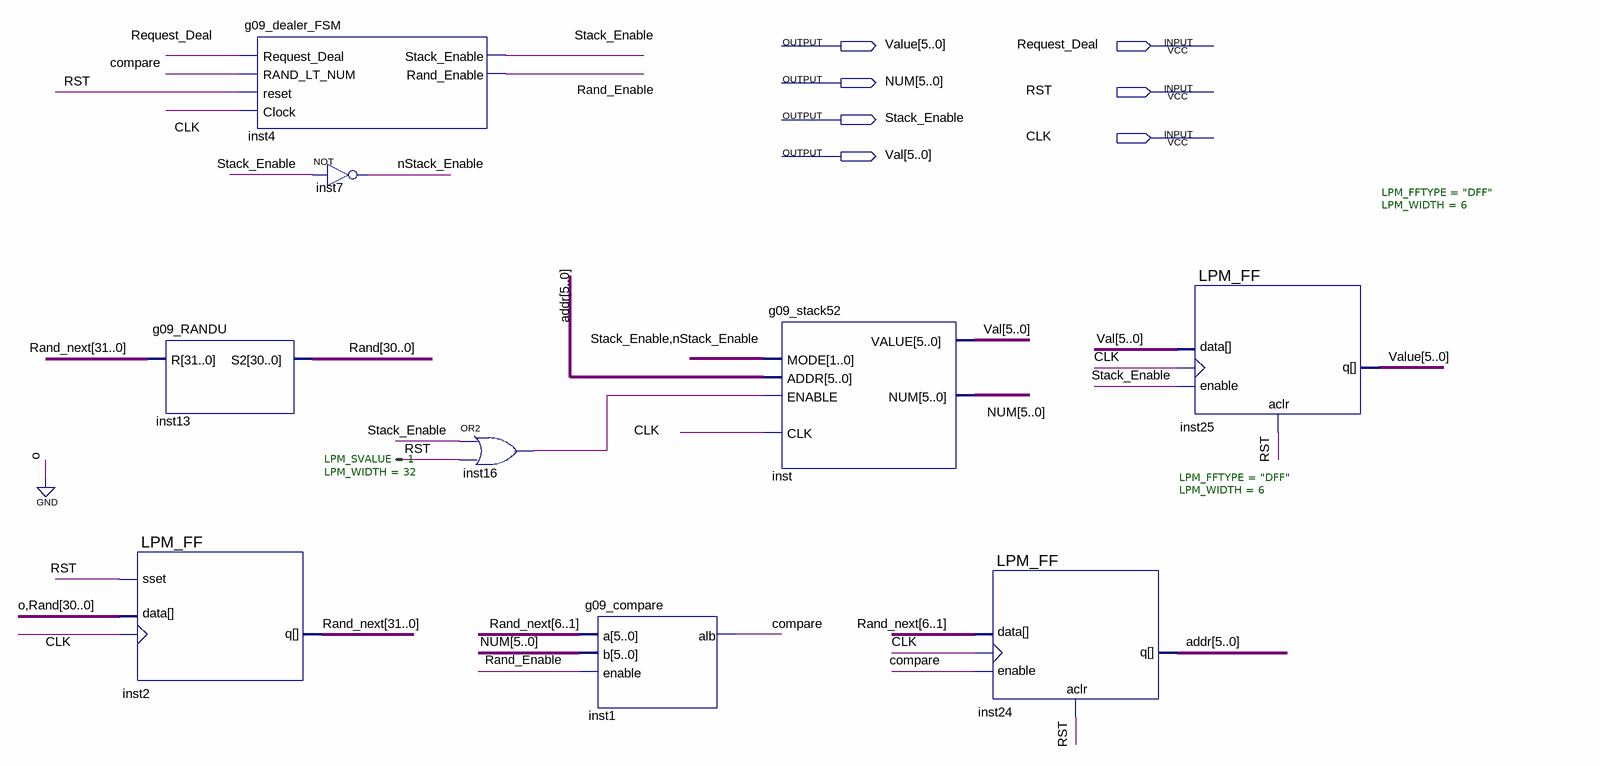
[diagram p0: schematic sheet]
// Quartus schematic g09_dealer_testbed.bdf as structural Verilog: 9 symbols, 7 pins
module g09_dealer_testbed (
  input  Request_Deal,
  input  RST,
  input  CLK,
  output [5:0] Value,
  output [5:0] NUM,
  output Stack_Enable,
  output [5:0] Val
);

  wire compare, inst16_out, nStack_Enable, Rand_Enable;
  wire [5:0] addr;
  wire [30:0] Rand;
  wire [31:0] Rand_next;

  g09_RANDU inst13 (.R(Rand_next), .S2(Rand));
  LPM_FF #(.LPM_SVALUE(1), .LPM_WIDTH(32)) inst2 (.clock(CLK), .data({1'b0, Rand}), .sset(RST), .q(Rand_next));
  g09_dealer_FSM inst4 (
    .Request_Deal(Request_Deal), .RAND_LT_NUM(compare), .reset(RST), .Clock(CLK),
    .Stack_Enable(Stack_Enable), .Rand_Enable(Rand_Enable));
  not inst7 (nStack_Enable, Stack_Enable);
  or inst16 (inst16_out, Stack_Enable, RST);
  g09_compare inst1 (.a(Rand_next[6:1]), .b(NUM), .enable(Rand_Enable), .alb(compare));
  g09_stack52 inst (
    .ADDR(addr), .CLK(CLK), .ENABLE(inst16_out), .MODE({Stack_Enable, nStack_Enable}), .NUM(NUM), .VALUE(Val));
  LPM_FF #(.LPM_FFTYPE("DFF"), .LPM_WIDTH(6)) inst24 (
    .enable(compare), .clock(CLK), .aclr(RST), .data(Rand_next[6:1]), .q(addr));
  LPM_FF #(.LPM_FFTYPE("DFF"), .LPM_WIDTH(6)) inst25 (
    .enable(Stack_Enable), .clock(CLK), .aclr(RST), .data(Val), .q(Value));
endmodule
